# Altium project LIB_TEST.PrjPcb (part 4 of 4)
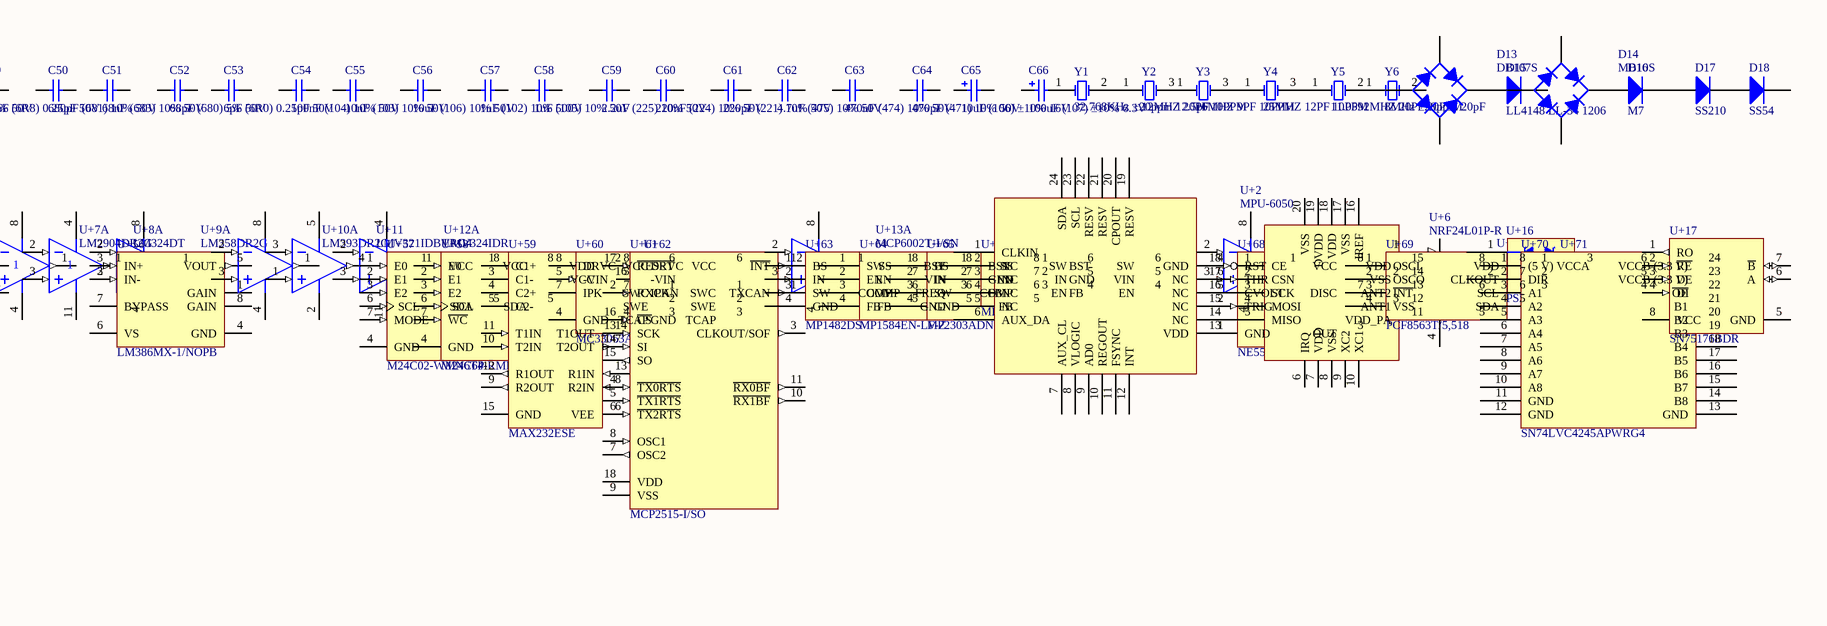
[diagram p8: 3.SchDoc, right]

## Sheet 3.SchDoc (continued)

### Notes on the sheet
- (in symbol CP2102-GMR) CP2102

### Library data of the parts
C1 = 0603 680pF (681) 10% 50V: 贴片电容; ComponentLink1Description: 供应商链接; ComponentLink1URL: http://www.szlcsc.com/product/details_1982.html; Package: 0603; Supplier: LC; SuppliersPartNumber: C1630
C2 = 0603 68nF (683) 10% 50V: 贴片电容; ComponentLink1Description: 供应商链接; ComponentLink1URL: http://www.szlcsc.com/product/details_32617.html; Package: 0603; Supplier: LC; SuppliersPartNumber: C31658
C3 = 0603 68pF (680) 5% 50V: 贴片电容; ComponentLink1Description: 供应商链接; ComponentLink1URL: http://www.szlcsc.com/product/details_29012.html; Package: 0603; Supplier: LC; SuppliersPartNumber: C28262
C4 = 0603 6pF (6R0) 0.25pF 50V: 贴片电容; ComponentLink1Description: 供应商链接; ComponentLink1URL: http://www.szlcsc.com/product/details_38453.html; Package: 0603; Supplier: LC; SuppliersPartNumber: C37474
C5 = 0603 8.2nF (822) 10% 50V: 贴片电容; ComponentLink1Description: 供应商链接; ComponentLink1URL: http://www.szlcsc.com/product/details_28670.html; Package: 0603; Supplier: LC; SuppliersPartNumber: C27920
C6 = 0603 8.2pF (8R2) 0.25pF 50V: 贴片电容; ComponentLink1Description: 供应商链接; ComponentLink1URL: http://www.szlcsc.com/product/details_2037.html; Package: 0603; Supplier: LC; SuppliersPartNumber: C1685
C7 = 0603 82pF (820) 5% 50V: 贴片电容; ComponentLink1Description: 供应商链接; ComponentLink1URL: http://www.szlcsc.com/product/details_2035.html; Package: 0603; Supplier: LC; SuppliersPartNumber: C1683
C8 = 0805 1.0pF (010) 0.25pF 50V: 贴片电容; ComponentLink1Description: 供应商链接; ComponentLink1URL: http://www.szlcsc.com/product/details_15644.html; Package: 0805; Supplier: LC; SuppliersPartNumber: C14971
C9 = 0805 1.5nF (152) 10% 50V: 贴片电容; ComponentLink1Description: 供应商链接; ComponentLink1URL: http://www.szlcsc.com/product/details_2069.html; Package: 0805; Supplier: LC; SuppliersPartNumber: C1717
C10 = 0805 1.5pF (1R5) 0.25pF 50V: 贴片电容; ComponentLink1Description: 供应商链接; ComponentLink1URL: http://www.szlcsc.com/product/details_2140.html; Package: 0805; Supplier: LC; SuppliersPartNumber: C1788
C11 = 0805 100nF(104) 10% 50V: 贴片电容; ComponentLink1Description: 供应商链接; ComponentLink1URL: http://www.szlcsc.com/product/details_50686.html; Package: 0805; Supplier: LC; SuppliersPartNumber: C49678
C12 = 0805 100pF (101) 5% 50V: 贴片电容; ComponentLink1Description: 供应商链接; ComponentLink1URL: http://www.szlcsc.com/product/details_2142.html; Package: 0805; Supplier: LC; SuppliersPartNumber: C1790
C13 = 0805 10nF (103) 10% 50V: 贴片电容; ComponentLink1Description: 供应商链接; ComponentLink1URL: http://www.szlcsc.com/product/details_2062.html; Package: 0805; Supplier: LC; SuppliersPartNumber: C1710
C14 = 0805 10pF (100) 5% 50V: 贴片电容; ComponentLink1Description: 供应商链接; ComponentLink1URL: http://www.szlcsc.com/product/details_2137.html; Package: 0805; Supplier: LC; SuppliersPartNumber: C1785
C15 = 0805 10uF (106) 10% 25V: 贴片电容; ComponentLink1Description: 供应商链接; ComponentLink1URL: http://www.szlcsc.com/product/details_16532.html; Package: 0805; Supplier: LC; SuppliersPartNumber: C15850
C16 = 0805 12pF (120) 5% 50V: 贴片电容; ComponentLink1Description: 供应商链接; ComponentLink1URL: http://www.szlcsc.com/product/details_2144.html; Package: 0805; Supplier: LC; SuppliersPartNumber: C1792
C17 = 0805 150pF (151) 10% 50V: 贴片电容; ComponentLink1Description: 供应商链接; ComponentLink1URL: http://www.szlcsc.com/product/details_2068.html; Package: 0805; Supplier: LC; SuppliersPartNumber: C1716
C18 = 0805 15pF (150) 5% 50V: 贴片电容; ComponentLink1Description: 供应商链接; ComponentLink1URL: http://www.szlcsc.com/product/details_2146.html; Package: 0805; Supplier: LC; SuppliersPartNumber: C1794
C19 = 0805 18pF (180) 5% 50V: 贴片电容; ComponentLink1Description: 供应商链接; ComponentLink1URL: http://www.szlcsc.com/product/details_2149.html; Package: 0805; Supplier: LC; SuppliersPartNumber: C1797
C20 = 0805 1nF (102) 10% 50V: 贴片电容; ComponentLink1Description: 供应商链接; ComponentLink1URL: http://www.szlcsc.com/product/details_52223.html; Package: 0805; Supplier: LC; SuppliersPartNumber: C51210
C21 = 0805 1uF (105) 10% 50V: 贴片电容; ComponentLink1Description: 供应商链接; ComponentLink1URL: http://www.szlcsc.com/product/details_29074.html; Package: 0805; Supplier: LC; SuppliersPartNumber: C28323
C22 = 0805 2.0pF (2R0) 0.25pF 50V: 贴片电容; ComponentLink1Description: 供应商链接; ComponentLink1URL: http://www.szlcsc.com/product/details_2152.html; Package: 0805; Supplier: LC; SuppliersPartNumber: C1800
C23 = 0805 2.2nF (222) 5% 50V: 贴片电容; ComponentLink1Description: 供应商链接; ComponentLink1URL: http://www.szlcsc.com/product/details_29010.html; Package: 0805; Supplier: LC; SuppliersPartNumber: C28260
C24 = 0805 2.2uF (225) 20% 50V: 贴片电容; ComponentLink1Description: 供应商链接; ComponentLink1URL: http://www.szlcsc.com/product/details_50225.html; Package: 0805; Supplier: LC; SuppliersPartNumber: C49217
C25 = 0805 2.7pF (2R7) 0.25pF 50V: 贴片电容; ComponentLink1Description: 供应商链接; ComponentLink1URL: http://www.szlcsc.com/product/details_2155.html; Package: 0805; Supplier: LC; SuppliersPartNumber: C1803
C26 = 0805 200pF (201) 10% 50V: 贴片电容; ComponentLink1Description: 供应商链接; ComponentLink1URL: http://www.szlcsc.com/product/details_2076.html; Package: 0805; Supplier: LC; SuppliersPartNumber: C1724
C27 = 0805 20pF (200) 5% 50V: 贴片电容; ComponentLink1Description: 供应商链接; ComponentLink1URL: http://www.szlcsc.com/product/details_2150.html; Package: 0805; Supplier: LC; SuppliersPartNumber: C1798
C28 = 0805 220nF (224) 10% 50V: 贴片电容; ComponentLink1Description: 供应商链接; ComponentLink1URL: http://www.szlcsc.com/product/details_5810.html; Package: 0805; Supplier: LC; SuppliersPartNumber: C5378
C29 = 0805 220pF (221) 10% 50V: 贴片电容; ComponentLink1Description: 供应商链接; ComponentLink1URL: http://www.szlcsc.com/product/details_54188.html; Package: 0805; Supplier: LC; SuppliersPartNumber: C53172
C30 = 0805 22nF (223) 10% 50V: 贴片电容; ComponentLink1Description: 供应商链接; ComponentLink1URL: http://www.szlcsc.com/product/details_2081.html; Package: 0805; Supplier: LC; SuppliersPartNumber: C1729
C31 = 0805 22pF (220) 5% 50V: 贴片电容; ComponentLink1Description: 供应商链接; ComponentLink1URL: http://www.szlcsc.com/product/details_2156.html; Package: 0805; Supplier: LC; SuppliersPartNumber: C1804
C32 = 0805 22uF (226) 20% 25V: 贴片电容; ComponentLink1Description: 供应商链接; ComponentLink1URL: http://www.szlcsc.com/product/details_46786.html; Package: 0805; Supplier: LC; SuppliersPartNumber: C45783
C33 = 0805 27pF (270) 5% 50V: 贴片电容; ComponentLink1Description: 供应商链接; ComponentLink1URL: http://www.szlcsc.com/product/details_8509.html; Package: 0805; Supplier: LC; SuppliersPartNumber: C8031
C34 = 0805 3.3nF (332) 10% 50V: 贴片电容; ComponentLink1Description: 供应商链接; ComponentLink1URL: http://www.szlcsc.com/product/details_54191.html; Package: 0805; Supplier: LC; SuppliersPartNumber: C53175
C35 = 0805 30pF (300) 5% 50V: 贴片电容; ComponentLink1Description: 供应商链接; ComponentLink1URL: http://www.szlcsc.com/product/details_2161.html; Package: 0805; Supplier: LC; SuppliersPartNumber: C1809
C36 = 0805 330nF (334) 10% 50V: 贴片电容; ComponentLink1Description: 供应商链接; ComponentLink1URL: http://www.szlcsc.com/product/details_2092.html; Package: 0805; Supplier: LC; SuppliersPartNumber: C1740
C37 = 0805 330pF (331) 10% 50V: 贴片电容; ComponentLink1Description: 供应商链接; ComponentLink1URL: http://www.szlcsc.com/product/details_52220.html; Package: 0805; Supplier: LC; SuppliersPartNumber: C51207
C38 = 0805 33nF (333) 10% 50V: 贴片电容; ComponentLink1Description: 供应商链接; ComponentLink1URL: http://www.szlcsc.com/product/details_2091.html; Package: 0805; Supplier: LC; SuppliersPartNumber: C1739
C39 = 0805 33pF (330) 5% 50V: 贴片电容; ComponentLink1Description: 供应商链接; ComponentLink1URL: http://www.szlcsc.com/product/details_2166.html; Package: 0805; Supplier: LC; SuppliersPartNumber: C1814
C40 = 0805 4.7nF (472) 10% 50V: 贴片电容; ComponentLink1Description: 供应商链接; ComponentLink1URL: http://www.szlcsc.com/product/details_2096.html; Package: 0805; Supplier: LC; SuppliersPartNumber: C1744
C41 = 0805 4.7pF (4R7) 0.25pF 50V: 贴片电容; ComponentLink1Description: 供应商链接; ComponentLink1URL: http://www.szlcsc.com/product/details_2172.html; Package: 0805; Supplier: LC; SuppliersPartNumber: C1820
C42 = 0805 4.7uF (475) 10% 25V: 贴片电容; ComponentLink1Description: 供应商链接; ComponentLink1URL: http://www.szlcsc.com/product/details_2131.html; Package: 0805; Supplier: LC; SuppliersPartNumber: C1779
C43 = 0805 470nF (474) 10% 50V: 贴片电容; ComponentLink1Description: 供应商链接; ComponentLink1URL: http://www.szlcsc.com/product/details_14623.html; Package: 0805; Supplier: LC; SuppliersPartNumber: C13967
C44 = 0805 470pF (471) 10% 50V: 贴片电容; ComponentLink1Description: 供应商链接; ComponentLink1URL: http://www.szlcsc.com/product/details_2095.html; Package: 0805; Supplier: LC; SuppliersPartNumber: C1743
C45 = 0805 47nF (473) 10% 50V: 贴片电容; ComponentLink1Description: 供应商链接; ComponentLink1URL: http://www.szlcsc.com/product/details_54150.html; Package: 0805; Supplier: LC; SuppliersPartNumber: C53134
C46 = 0805 47pF (470) 5% 50V: 贴片电容; ComponentLink1Description: 供应商链接; ComponentLink1URL: http://www.szlcsc.com/product/details_15529.html; Package: 0805; Supplier: LC; SuppliersPartNumber: C14857
C47 = 0805 56pF (560) 5% 50V: 贴片电容; ComponentLink1Description: 供应商链接; ComponentLink1URL: http://www.szlcsc.com/product/details_2180.html; Package: 0805; Supplier: LC; SuppliersPartNumber: C1828
C48 = 0805 6.8nF (682) 10% 50V: 贴片电容; ComponentLink1Description: 供应商链接; ComponentLink1URL: http://www.szlcsc.com/product/details_2107.html; Package: 0805; Supplier: LC; SuppliersPartNumber: C1755
C49 = 0805 6.8pF (6R8) 0.25pF 50V: 贴片电容; ComponentLink1Description: 供应商链接; ComponentLink1URL: http://www.szlcsc.com/product/details_2184.html; Package: 0805; Supplier: LC; SuppliersPartNumber: C1832
C50 = 0805 680pF (681) 10% 50V: 贴片电容; ComponentLink1Description: 供应商链接; ComponentLink1URL: http://www.szlcsc.com/product/details_54166.html; Package: 0805; Supplier: LC; SuppliersPartNumber: C53150
C51 = 0805 68nF (683) 10% 50V: 贴片电容; ComponentLink1Description: 供应商链接; ComponentLink1URL: http://www.szlcsc.com/product/details_2108.html; Package: 0805; Supplier: LC; SuppliersPartNumber: C1756
C52 = 0805 68pF (680) 5% 50V: 贴片电容; ComponentLink1Description: 供应商链接; ComponentLink1URL: http://www.szlcsc.com/product/details_2186.html; Package: 0805; Supplier: LC; SuppliersPartNumber: C1834
C53 = 0805 6pF (6R0) 0.25pF 50V: 贴片电容; ComponentLink1Description: 供应商链接; ComponentLink1URL: http://www.szlcsc.com/product/details_68656.html; Package: 0805; Supplier: LC; SuppliersPartNumber: C67560
C54 = 1206 100nF (104) 10% 50V: 贴片电容; ComponentLink1Description: 供应商链接; ComponentLink1URL: http://www.szlcsc.com/product/details_25237.html; Package: 1206; Supplier: LC; SuppliersPartNumber: C24497
C55 = 1206 10nF (103) 10% 50V: 贴片电容; ComponentLink1Description: 供应商链接; ComponentLink1URL: http://www.szlcsc.com/product/details_2198.html; Package: 1206; Supplier: LC; SuppliersPartNumber: C1846
C56 = 1206 10uF (106) 10% 50V: 贴片电容; ComponentLink1Description: 供应商链接; ComponentLink1URL: http://www.szlcsc.com/product/details_14236.html; Package: 1206; Supplier: LC; SuppliersPartNumber: C13585
C57 = 1206 1nF (102) 10% 500V: 贴片电容; ComponentLink1Description: 供应商链接; ComponentLink1URL: http://www.szlcsc.com/product/details_36187.html; Package: 1206; Supplier: LC; SuppliersPartNumber: C35216
C58 = 1206 1uF (105) 10% 50V: 贴片电容; ComponentLink1Description: 供应商链接; ComponentLink1URL: http://www.szlcsc.com/product/details_2200.html; Package: 1206; Supplier: LC; SuppliersPartNumber: C1848
C59 = 1206 2.2uF (225) 10% 50V: 贴片电容; ComponentLink1Description: 供应商链接; ComponentLink1URL: http://www.szlcsc.com/product/details_13292.html; Package: 1206; Supplier: LC; SuppliersPartNumber: C12656
C60 = 1206 220nF (224) 10% 50V: 贴片电容; ComponentLink1Description: 供应商链接; ComponentLink1URL: http://www.szlcsc.com/product/details_2209.html; Package: 1206; Supplier: LC; SuppliersPartNumber: C1857
C61 = 1206 220pF (221) 10% 50V: 贴片电容; ComponentLink1Description: 供应商链接; ComponentLink1URL: http://www.szlcsc.com/product/details_2206.html; Package: 1206; Supplier: LC; SuppliersPartNumber: C1854
C62 = 1206 4.7uF (475) 10% 50V: 贴片电容; ComponentLink1Description: 供应商链接; ComponentLink1URL: http://www.szlcsc.com/product/details_30577.html; Package: 1206; Supplier: LC; SuppliersPartNumber: C29823
C63 = 1206 470nF (474) 10% 50V: 贴片电容; ComponentLink1Description: 供应商链接; ComponentLink1URL: http://www.szlcsc.com/product/details_2223.html; Package: 1206; Supplier: LC; SuppliersPartNumber: C1871
C64 = 1206 470pF (471) 10% 50V: 贴片电容; ComponentLink1Description: 供应商链接; ComponentLink1URL: http://www.szlcsc.com/product/details_2220.html; Package: 1206; Supplier: LC; SuppliersPartNumber: C1868
C65 = 3216 10uF (106) 10% 16V: 钽电容; ComponentLink1Description: 供应商链接; ComponentLink1URL: http://www.szlcsc.com/product/details_7643.html; Package: 3216; Supplier: LC; SuppliersPartNumber: C7171
C66 = 3528 100uF (107) 10% 6.3V: 钽电容; ComponentLink1Description: 供应商链接; ComponentLink1URL: http://www.szlcsc.com/product/details_16815.html; Package: 3528; Supplier: LC; SuppliersPartNumber: C16133
D13 = DBS DB107S: 整流桥; ComponentLink1Description: 供应商链接; ComponentLink1URL: http://www.szlcsc.com/product/details_5809.html; Package: DBS; Supplier: LC; SuppliersPartNumber: C5377
D14 = MBS MB10S: 整流桥; ComponentLink1Description: 供应商链接; ComponentLink1URL: http://www.szlcsc.com/product/details_2865.html; Package: MBS; Supplier: LC; SuppliersPartNumber: C2488
D15 = LL-34 LL4148 LL-34 1206: 开关二极管; ComponentLink1Description: 供应商链接; ComponentLink1URL: http://www.szlcsc.com/product/details_10338.html; Package: LL-34; Supplier: LC; SuppliersPartNumber: C9808
D16 = SMA(DO-214AC) M7: 二极管; ComponentLink1Description: 供应商链接; ComponentLink1URL: http://www.szlcsc.com/product/details_2841.html; Package: SMA(DO-214AC); Supplier: LC; SuppliersPartNumber: C2464
D17 = SMA(DO-214AC) SS210: 二极管; ComponentLink1Description: 供应商链接; ComponentLink1URL: http://www.szlcsc.com/product/details_15669.html; Package: SMA(DO-214AC); Supplier: LC; SuppliersPartNumber: C14996
D18 = SMA(DO-214AC) SS54: 二极管; ComponentLink1Description: 供应商链接; ComponentLink1URL: http://www.szlcsc.com/product/details_23178.html; Package: SMA(DO-214AC); Supplier: LC; SuppliersPartNumber: C22452
D19 = SMA(DO-214AC) US1M: 二极管; ComponentLink1Description: 供应商链接; ComponentLink1URL: http://www.szlcsc.com/product/details_5885.html; Package: SMA(DO-214AC); Supplier: LC; SuppliersPartNumber: C5441
D20 = SMB/DO-214AA P6SMB6.8CA: TVS; ComponentLink1Description: 供应商链接; ComponentLink1URL: http://www.szlcsc.com/product/details_79530.html; Package: SMB/DO-214AA; Supplier: LC; SuppliersPartNumber: C78395
D21 = SMC(DO-214AB) SS36-E3/57T: 二极管; ComponentLink1Description: 供应商链接; ComponentLink1URL: http://www.szlcsc.com/product/details_36698.html; Package: SMC(DO-214AB); Supplier: LC; SuppliersPartNumber: C35722
D22 = SOD-123 B5819W  SL: 肖特基二极管; ComponentLink1Description: 供应商链接; ComponentLink1URL: http://www.szlcsc.com/product/details_9093.html; Package: SOD-123; Supplier: LC; SuppliersPartNumber: C8598
D23 = SOD-323 1N4148WS T4: 二极管; ComponentLink1Description: 供应商链接; ComponentLink1URL: http://www.szlcsc.com/product/details_2485.html; Package: SOD-323; Supplier: LC; SuppliersPartNumber: C2128
D24 = SOT-23 BAV70 A4: 开关二极管; ComponentLink1Description: 供应商链接; ComponentLink1URL: http://www.szlcsc.com/product/details_70091.html; Package: SOT-23; Supplier: LC; SuppliersPartNumber: C68978
D25 = SOT-23 BAV99 A7W: 开关二极管; ComponentLink1Description: 供应商链接; ComponentLink1URL: http://www.szlcsc.com/product/details_2877.html; Package: SOT-23; Supplier: LC; SuppliersPartNumber: C2500
L16 = 0402 10nH 5%: 贴片电感; ComponentLink1Description: 供应商链接; ComponentLink1URL: http://www.szlcsc.com/product/details_27896.html; Package: 0402; Supplier: LC; SuppliersPartNumber: C27147
L17 = 0402 12nH  5%: 贴片电感; ComponentLink1Description: 供应商链接; ComponentLink1URL: http://www.szlcsc.com/product/details_25303.html; Package: 0402; Supplier: LC; SuppliersPartNumber: C24563
L18 = 0402 15nH 5%: 贴片电感; ComponentLink1Description: 供应商链接; ComponentLink1URL: http://www.szlcsc.com/product/details_27892.html; Package: 0402; Supplier: LC; SuppliersPartNumber: C27143
L19 = 0402 18nH: 贴片电感; ComponentLink1Description: 供应商链接; ComponentLink1URL: http://www.szlcsc.com/product/details_25302.html; Package: 0402; Supplier: LC; SuppliersPartNumber: C24562
L20 = 0402 2.7nH 0.3nH: 贴片电感; ComponentLink1Description: 供应商链接; ComponentLink1URL: http://www.szlcsc.com/product/details_27872.html; Package: 0402; Supplier: LC; SuppliersPartNumber: C27123
L21 = 0402 27nH 5%: 贴片电感; ComponentLink1Description: 供应商链接; ComponentLink1URL: http://www.szlcsc.com/product/details_19533.html; Package: 0402; Supplier: LC; SuppliersPartNumber: C18830
L22 = 0402 3.3nH 0.3nH: 贴片电感; ComponentLink1Description: 供应商链接; ComponentLink1URL: http://www.szlcsc.com/product/details_27873.html; Package: 0402; Supplier: LC; SuppliersPartNumber: C27124
L23 = 0402 3.9nH 3%: 贴片电感; ComponentLink1Description: 供应商链接; ComponentLink1URL: http://www.szlcsc.com/product/details_14690.html; Package: 0402; Supplier: LC; SuppliersPartNumber: C14033
L24 = 0402 39nH: 贴片电感; ComponentLink1Description: 供应商链接; ComponentLink1URL: http://www.szlcsc.com/product/details_27187.html; Package: 0402; Supplier: LC; SuppliersPartNumber: C26443
L25 = 0402 4.7nH 0.3nH: 贴片电感; ComponentLink1Description: 供应商链接; ComponentLink1URL: http://www.szlcsc.com/product/details_14246.html; Package: 0402; Supplier: LC; SuppliersPartNumber: C13595
L26 = 0402 6.8nH 5%: 贴片电感; ComponentLink1Description: 供应商链接; ComponentLink1URL: http://www.szlcsc.com/product/details_33003.html; Package: 0402; Supplier: LC; SuppliersPartNumber: C32041
L27 = 0402 8.2nH 5%: 贴片电感; ComponentLink1Description: 供应商链接; ComponentLink1URL: http://www.szlcsc.com/product/details_16890.html; Package: 0402; Supplier: LC; SuppliersPartNumber: C16208
L28 = 0603 10nH 5%: 贴片电感; ComponentLink1Description: 供应商链接; ComponentLink1URL: http://www.szlcsc.com/product/details_16347.html; Package: 0603; Supplier: LC; SuppliersPartNumber: C15666
L29 = 0603 10uH 10%: 贴片电感; ComponentLink1Description: 供应商链接; ComponentLink1URL: http://www.szlcsc.com/product/details_1387.html; Package: 0603; Supplier: LC; SuppliersPartNumber: C1035
L30 = 0603 12nH 5%: 贴片电感; ComponentLink1Description: 供应商链接; ComponentLink1URL: http://www.szlcsc.com/product/details_30010.html; Package: 0603; Supplier: LC; SuppliersPartNumber: C29258
L31 = 0603 22nH 5%: 贴片电感; ComponentLink1Description: 供应商链接; ComponentLink1URL: http://www.szlcsc.com/product/details_12684.html; Package: 0603; Supplier: LC; SuppliersPartNumber: C12099
L32 = 0603 27nH 5%: 贴片电感; ComponentLink1Description: 供应商链接; ComponentLink1URL: http://www.szlcsc.com/product/details_12685.html; Package: 0603; Supplier: LC; SuppliersPartNumber: C12100
L33 = 0603 3.9nH 0.3nH: 贴片电感; ComponentLink1Description: 供应商链接; ComponentLink1URL: http://www.szlcsc.com/product/details_14473.html; Package: 0603; Supplier: LC; SuppliersPartNumber: C13818
L34 = 0603 33nH 5%: 贴片电感; ComponentLink1Description: 供应商链接; ComponentLink1URL: http://www.szlcsc.com/product/details_36021.html; Package: 0603; Supplier: LC; SuppliersPartNumber: C35050
L35 = 0603 4.7nH 0.3nH: 贴片电感; ComponentLink1Description: 供应商链接; ComponentLink1URL: http://www.szlcsc.com/product/details_1382.html; Package: 0603; Supplier: LC; SuppliersPartNumber: C1030
U+1 = HT1621B: LCD驱动; ComponentLink1Description: 供应商链接; ComponentLink1URL: http://www.szlcsc.com/product/details_8009.html; Package: LQFP-48_7x7x05P; Supplier: LC; SuppliersPartNumber: C7532
U+2 = MPU-6050: 传感器; ComponentLink1Description: 供应商链接; ComponentLink1URL: http://www.szlcsc.com/product/details_24852.html; Package: QFN-24_4x4x05P; Supplier: LC; SuppliersPartNumber: C24112
U+3 = CP2102-GMR: USB; ComponentLink1Description: 供应商链接; ComponentLink1URL: http://www.szlcsc.com/product/details_7033.html; Package: QFN-28_5x5x05P; Supplier: LC; SuppliersPartNumber: C6568
U+4 = CP2104-F03-GM: USB; ComponentLink1Description: 供应商链接; ComponentLink1URL: http://www.szlcsc.com/product/details_48747.html; Package: QFN-24_4x4x05P; Supplier: LC; SuppliersPartNumber: C47742
U+5 = CC2530F256RHAT: 无线; ComponentLink1Description: 供应商链接; ComponentLink1URL: http://www.szlcsc.com/product/details_9643.html; Package: QFN-40_6x6x05P; Supplier: LC; SuppliersPartNumber: C9120
U+6 = NRF24L01P-R: 无线; ComponentLink1Description: 供应商链接; ComponentLink1URL: http://www.szlcsc.com/product/details_9305.html; Package: QFN-20_4x4x05P; Supplier: LC; SuppliersPartNumber: C8791
U+7 = LM2904DR2G: 运放; ComponentLink1Description: 供应商链接; ComponentLink1URL: http://www.szlcsc.com/product/details_18922.html; Package: SOIC-8_150mil; Supplier: LC; SuppliersPartNumber: C18229
U+8 = LM324DT: 运放; ComponentLink1Description: 供应商链接; ComponentLink1URL: http://www.szlcsc.com/product/details_72134.html; Package: SOIC-14_150mil; Supplier: LC; SuppliersPartNumber: C71035
U+9 = LM358DR2G: 通用运放; ComponentLink1Description: 供应商链接; ComponentLink1URL: http://www.szlcsc.com/product/details_8427.html; Package: SOIC-8; Supplier: LC; SuppliersPartNumber: C7950
U+10 = LM393DR2G: 电压比较器; ComponentLink1Description: 供应商链接; ComponentLink1URL: http://www.szlcsc.com/product/details_8432.html; Package: SOIC-8; Supplier: LC; SuppliersPartNumber: C7955
U+11 = LMV321IDBVRG4: 运放; ComponentLink1Description: 供应商链接; ComponentLink1URL: http://www.szlcsc.com/product/details_8449.html; Package: SOT-23-5; Supplier: LC; SuppliersPartNumber: C7972
U+12 = LMV324IDR: 运放; ComponentLink1Description: 供应商链接; ComponentLink1URL: http://www.szlcsc.com/product/details_8451.html; Package: SOIC-14_150mil; Supplier: LC; SuppliersPartNumber: C7974
U+13 = MCP6002T-I/SN: 运放; ComponentLink1Description: 供应商链接; ComponentLink1URL: http://www.szlcsc.com/product/details_7854.html; Package: SOIC-8_150mil; Supplier: LC; SuppliersPartNumber: C7377
U+14 = NE5532DR: 功放; ComponentLink1Description: 供应商链接; ComponentLink1URL: http://www.szlcsc.com/product/details_7903.html; Package: SOIC-8_150mil; Supplier: LC; SuppliersPartNumber: C7426
U+15 = CH340G: USB; ComponentLink1Description: 供应商链接; ComponentLink1URL: http://www.szlcsc.com/product/details_14927.html; Package: SOIC-16_150mil; Supplier: LC; SuppliersPartNumber: C14267
U+16 = PSM712-LF-T7: TVS; ComponentLink1Description: 供应商链接; ComponentLink1URL: http://www.szlcsc.com/product/details_33642.html; Package: SOT-23(SOT-23-3); Supplier: LC; SuppliersPartNumber: C32677
U+17 = SN75176BDR: RS-485/RS-422; ComponentLink1Description: 供应商链接; ComponentLink1URL: http://www.szlcsc.com/product/details_7535.html; Package: SOIC-8_150mil; Supplier: LC; SuppliersPartNumber: C7063
U+18 = 74HC04D: 74系列逻辑芯片; ComponentLink1Description: 供应商链接; ComponentLink1URL: http://www.szlcsc.com/product/details_6041.html; Package: SOIC-14_150mil; Supplier: LC; SuppliersPartNumber: C5590
U+19 = 74HC08D: 74系列逻辑芯片; ComponentLink1Description: 供应商链接; ComponentLink1URL: http://www.szlcsc.com/product/details_6044.html; Package: SOIC-14_150mil; Supplier: LC; SuppliersPartNumber: C5593
U+20 = 74HC14D: 74系列逻辑芯片; ComponentLink1Description: 供应商链接; ComponentLink1URL: http://www.szlcsc.com/product/details_6056.html; Package: SOIC-14_150mil; Supplier: LC; SuppliersPartNumber: C5605
U+21 = AD620ARZ-REEL: 仪放; ComponentLink1Description: 供应商链接; ComponentLink1URL: http://www.szlcsc.com/product/details_10205.html; Package: SOIC-8_150mil; Supplier: LC; SuppliersPartNumber: C9675
U+22 = CJ431 0.5%431: 电压基准; ComponentLink1Description: 供应商链接; ComponentLink1URL: http://www.szlcsc.com/product/details_3500.html; Package: SOT-23; Supplier: LC; SuppliersPartNumber: C3113
U+23 = OP07CDR: 精密运放; ComponentLink1Description: 供应商链接; ComponentLink1URL: http://www.szlcsc.com/product/details_7910.html; Package: SOIC-8; Supplier: LC; SuppliersPartNumber: C7433
U+24 = 74HC138D: 74系列逻辑芯片; ComponentLink1Description: 供应商链接; ComponentLink1URL: http://www.szlcsc.com/product/details_6053.html; Package: SOIC-16_150mil; Supplier: LC; SuppliersPartNumber: C5602
U+25 = 74HC164D: 74系列逻辑芯片; ComponentLink1Description: 供应商链接; ComponentLink1URL: http://www.szlcsc.com/product/details_7297.html; Package: SOIC-14_150mil; Supplier: LC; SuppliersPartNumber: C6825
U+26 = 74HC165D: 74系列逻辑芯片; ComponentLink1Description: 供应商链接; ComponentLink1URL: http://www.szlcsc.com/product/details_6064.html; Package: SOIC-16_150mil; Supplier: LC; SuppliersPartNumber: C5613
U+27 = 74HC244D: 74系列逻辑芯片; ComponentLink1Description: 供应商链接; ComponentLink1URL: http://www.szlcsc.com/product/details_6073.html; Package: SOIC-20_300mil; Supplier: LC; SuppliersPartNumber: C5622
U+28 = 74HC245D: 74系列逻辑芯片; ComponentLink1Description: 供应商链接; ComponentLink1URL: http://www.szlcsc.com/product/details_6076.html; Package: SOIC-20_300mil; Supplier: LC; SuppliersPartNumber: C5625
U+29 = 74HC573D: 74系列逻辑芯片; ComponentLink1Description: 供应商链接; ComponentLink1URL: http://www.szlcsc.com/product/details_6059.html; Package: SOIC-20_300mil; Supplier: LC; SuppliersPartNumber: C5608
U+30 = 74HC595D: 74系列逻辑芯片; ComponentLink1Description: 供应商链接; ComponentLink1URL: http://www.szlcsc.com/product/details_6413.html; Package: SOIC-16_150mil; Supplier: LC; SuppliersPartNumber: C5947
U+31 = ACS712ELCTR-20A-T: 传感器; ComponentLink1Description: 供应商链接; ComponentLink1URL: http://www.szlcsc.com/product/details_11225.html; Package: SOIC-8_150mil; Supplier: LC; SuppliersPartNumber: C10681
U+32 = ADM2483BRWZ: 接口芯片; ComponentLink1Description: 供应商链接; ComponentLink1URL: http://www.szlcsc.com/product/details_10167.html; Package: SOIC-16_300mil; Supplier: LC; SuppliersPartNumber: C9637
U+33 = ADUM1201ARZ-RL7: 隔离器; ComponentLink1Description: 供应商链接; ComponentLink1URL: http://www.szlcsc.com/product/details_10199.html; Package: SOIC-8_150mil; Supplier: LC; SuppliersPartNumber: C9669
U+34 = AM26LS31CDRG4: 接口芯片; ComponentLink1Description: 供应商链接; ComponentLink1URL: http://www.szlcsc.com/product/details_6645.html; Package: SOIC-16_150mil; Supplier: LC; SuppliersPartNumber: C6179
U+35 = AM26LS32ACDRG4: 接口芯片; ComponentLink1Description: 供应商链接; ComponentLink1URL: http://www.szlcsc.com/product/details_6646.html; Package: SOIC-16_150mil; Supplier: LC; SuppliersPartNumber: C6180
U+36 = CAN/PCA82C250T/YM: CAN; ComponentLink1Description: 供应商链接; ComponentLink1URL: http://www.szlcsc.com/product/details_7916.html; Package: SOIC-8_150mil; Supplier: LC; SuppliersPartNumber: C7439
U+37 = CAN/SN65HVD230DR: CAN; ComponentLink1Description: 供应商链接; ComponentLink1URL: http://www.szlcsc.com/product/details_12661.html; Package: SOIC-8_150mil; Supplier: LC; SuppliersPartNumber: C12084
U+38 = CAN/TJA1040T/CM: CAN; ComponentLink1Description: 供应商链接; ComponentLink1URL: http://www.szlcsc.com/product/details_7423.html; Package: SOIC-8_150mil; Supplier: LC; SuppliersPartNumber: C6951
U+39 = CAN/TJA1050T/CM: CAN; ComponentLink1Description: 供应商链接; ComponentLink1URL: http://www.szlcsc.com/product/details_7424.html; Package: SOIC-8_150mil; Supplier: LC; SuppliersPartNumber: C6952
U+40 = CAN/TJA1051T/3: CAN; ComponentLink1Description: 供应商链接; ComponentLink1URL: http://www.szlcsc.com/product/details_39678.html; Package: SOIC-8_150mil; Supplier: LC; SuppliersPartNumber: C38695
U+41 = CD4051BM96: 4000系列逻辑芯片; ComponentLink1Description: 供应商链接; ComponentLink1URL: http://www.szlcsc.com/product/details_22096.html; Package: SOIC-16_150mil; Supplier: LC; SuppliersPartNumber: C21379
U+42 = CD4052BM96: 4000系列逻辑芯片; ComponentLink1Description: 供应商链接; ComponentLink1URL: http://www.szlcsc.com/product/details_6986.html; Package: SOIC-16_150mil; Supplier: LC; SuppliersPartNumber: C6521
U+43 = CD4053BM96: 4000系列逻辑芯片; ComponentLink1Description: 供应商链接; ComponentLink1URL: http://www.szlcsc.com/product/details_7208.html; Package: SOIC-16_150mil; Supplier: LC; SuppliersPartNumber: C6742
U+44 = CH376S: USB; ComponentLink1Description: 供应商链接; ComponentLink1URL: http://www.szlcsc.com/product/details_14823.html; Package: SOIC-28_300mil; Supplier: LC; SuppliersPartNumber: C14166
U+45 = DP83848CVVX: 接口芯片; ComponentLink1Description: 供应商链接; ComponentLink1URL: http://www.szlcsc.com/product/details_17371.html; Package: LQFP-48_7x7x05P; Supplier: LC; SuppliersPartNumber: C16688
U+46 = DS1302Z+T&R: 实时时钟; ComponentLink1Description: 供应商链接; ComponentLink1URL: http://www.szlcsc.com/product/details_9478.html; Package: SOIC-8_150mil; Supplier: LC; SuppliersPartNumber: C8959
U+47 = DS3231M+TRL: 实时时钟; ComponentLink1Description: 供应商链接; ComponentLink1URL: http://www.szlcsc.com/product/details_38643.html; Package: SOIC-16_300mil; Supplier: LC; SuppliersPartNumber: C37663
U+48 = DW01+G: 电池保护芯片; ComponentLink1Description: 供应商链接; ComponentLink1URL: http://www.szlcsc.com/product/details_14870.html; Package: SOT-23-6; Supplier: LC; SuppliersPartNumber: C14213
U+49 = EEPROM/AT24C256C-SSHL-T: EEPROM; ComponentLink1Description: 供应商链接; ComponentLink1URL: http://www.szlcsc.com/product/details_6947.html; Package: SOIC-8_150mil; Supplier: LC; SuppliersPartNumber: C6482
U+50 = FT232RL-REEL: USB; ComponentLink1Description: 供应商链接; ComponentLink1URL: http://www.szlcsc.com/product/details_9194.html; Package: SSOP-28_208mil; Supplier: LC; SuppliersPartNumber: C8690
U+51 = FP6291: DC-DC芯片; ComponentLink1Description: 供应商链接; ComponentLink1URL: http://www.szlcsc.com/product/details_19404.html; Package: SOT-23-6; Supplier: LC; SuppliersPartNumber: C18701
U+52 = ICL7660AIBAZA-T: 电源芯片; ComponentLink1Description: 供应商链接; ComponentLink1URL: http://www.szlcsc.com/product/details_8358.html; Package: SOIC-8_150mil; Supplier: LC; SuppliersPartNumber: C7881
U+53 = ISO1050DUBR: CAN; ComponentLink1Description: 供应商链接; ComponentLink1URL: http://www.szlcsc.com/product/details_17110.html; Package: SMD-8_6.3mm; Supplier: LC; SuppliersPartNumber: C16428
U+54 = LM2576SX-5.0: DC-DC芯片; ComponentLink1Description: 供应商链接; ComponentLink1URL: http://www.szlcsc.com/product/details_35434.html; Package: TO-263-5; Supplier: LC; SuppliersPartNumber: C34465
U+55 = LM2596SX-5.0/NOPB: DC-DC芯片; ComponentLink1Description: 供应商链接; ComponentLink1URL: http://www.szlcsc.com/product/details_10538.html; Package: TO-263-5; Supplier: LC; SuppliersPartNumber: C10002
U+56 = LM386MX-1/NOPB: 功放; ComponentLink1Description: 供应商链接; ComponentLink1URL: http://www.szlcsc.com/product/details_24309.html; Package: SOIC-8_150mil; Supplier: LC; SuppliersPartNumber: C23573
U+57 = M24C02-WMN6TP: EEPROM; ComponentLink1Description: 供应商链接; ComponentLink1URL: http://www.szlcsc.com/product/details_8039.html; Package: SOIC-8_150mil; Supplier: LC; SuppliersPartNumber: C7562
U+58 = M24C64-RMN6TP: EEPROM; ComponentLink1Description: 供应商链接; ComponentLink1URL: http://www.szlcsc.com/product/details_81133.html; Package: SOIC-8_150mil; Supplier: LC; SuppliersPartNumber: C79988
U+59 = MAX232ESE: RS232; ComponentLink1Description: 供应商链接; ComponentLink1URL: http://www.szlcsc.com/product/details_27608.html; Package: SOIC-16_150mil; Supplier: LC; SuppliersPartNumber: C26860
U+60 = MC33063ADR2G: 开关电源; ComponentLink1Description: 供应商链接; ComponentLink1URL: http://www.szlcsc.com/product/details_7773.html; Package: SOIC-8_150mil; Supplier: LC; SuppliersPartNumber: C7296
U+61 = MCP2515-I/SO: CAN; ComponentLink1Description: 供应商链接; ComponentLink1URL: http://www.szlcsc.com/product/details_12992.html; Package: SOIC-18_300mil; Supplier: LC; SuppliersPartNumber: C12368
U+62 = MC34063ADR2G: DC-DC芯片; ComponentLink1Description: 供应商链接; ComponentLink1URL: http://www.szlcsc.com/product/details_33041.html; Package: SOIC-8; Supplier: LC; SuppliersPartNumber: C32078
U+63 = MP1482DS: 电源芯片; ComponentLink1Description: 供应商链接; ComponentLink1URL: http://www.szlcsc.com/product/details_15539.html; Package: SOIC-8_150mil; Supplier: LC; SuppliersPartNumber: C14867
U+64 = MP1584EN-LF-Z: DC-DC芯片; ComponentLink1Description: 供应商链接; ComponentLink1URL: http://www.szlcsc.com/product/details_15724.html; Package: SOIC-8_EP_150mil; Supplier: LC; SuppliersPartNumber: C15051
U+65 = MP2303ADN-LF-Z: DC-DC芯片; ComponentLink1Description: 供应商链接; ComponentLink1URL: http://www.szlcsc.com/product/details_19579.html; Package: SOIC-8_EP_150mil; Supplier: LC; SuppliersPartNumber: C18876
U+66 = MP2359DJ-LF-Z: DC-DC芯片; ComponentLink1Description: 供应商链接; ComponentLink1URL: http://www.szlcsc.com/product/details_14917.html; Package: SOT-23-6; Supplier: LC; SuppliersPartNumber: C14259
U+67 = MP2451DT-LF-Z: DC-DC芯片; ComponentLink1Description: 供应商链接; ComponentLink1URL: http://www.szlcsc.com/product/details_14780.html; Package: SOT-23-6; Supplier: LC; SuppliersPartNumber: C14123
U+68 = NE555DR: 时基集成; ComponentLink1Description: 供应商链接; ComponentLink1URL: http://www.szlcsc.com/product/details_8070.html; Package: SOIC-8_150mil; Supplier: LC; SuppliersPartNumber: C7593
U+69 = PCF8563T/5,518: 实时时钟; ComponentLink1Description: 供应商链接; ComponentLink1URL: http://www.szlcsc.com/product/details_7917.html; Package: SOIC-8_150mil; Supplier: LC; SuppliersPartNumber: C7440
U+70 = SN74LVC4245APWRG4: 74系列逻辑芯片; ComponentLink1Description: 供应商链接; ComponentLink1URL: http://www.szlcsc.com/product/details_8336.html; Package: TSSOP-24; Supplier: LC; SuppliersPartNumber: C7859
U+71 = SMF05CT1G: TVS; ComponentLink1Description: 供应商链接; ComponentLink1URL: http://www.szlcsc.com/product/details_16561.html; Package: SC-70-6(SOT-363); Supplier: LC; SuppliersPartNumber: C15879
U+72 = 6N137S(TA): 贴片光耦; ComponentLink1Description: 供应商链接; ComponentLink1URL: http://www.szlcsc.com/product/details_17178.html; Package: SMD-8_6.3mm; Supplier: LC; SuppliersPartNumber: C16496
U+73 = EL357N(B)(TA)-G: 贴片光耦; ComponentLink1Description: 供应商链接; ComponentLink1URL: http://www.szlcsc.com/product/details_7114.html; Package: SOP-4_P2.54; Supplier: LC; SuppliersPartNumber: C6649
U+74 = W5500: 以太网; ComponentLink1Description: 供应商链接; ComponentLink1URL: http://www.szlcsc.com/product/details_33808.html; Package: LQFP-48_7x7x05P; Supplier: LC; SuppliersPartNumber: C32843
U+75 = TL072CDT: 运放; ComponentLink1Description: 供应商链接; ComponentLink1URL: http://www.szlcsc.com/product/details_7433.html; Package: SOIC-8_150mil; Supplier: LC; SuppliersPartNumber: C6961
U+76 = SP3485EN-L/TR: RS-485/RS-422; ComponentLink1Description: 供应商链接; ComponentLink1URL: http://www.szlcsc.com/product/details_9482.html; Package: SOIC-8; Supplier: LC; SuppliersPartNumber: C8963
U+77 = SP485EEN-L/TR: RS-485/RS-422; ComponentLink1Description: 供应商链接; ComponentLink1URL: http://www.szlcsc.com/product/details_7327.html; Package: SOIC-8; Supplier: LC; SuppliersPartNumber: C6855
U+78 = SP3232EEY-L/TR: RS232; ComponentLink1Description: 供应商链接; ComponentLink1URL: http://www.szlcsc.com/product/details_14131.html; Package: TSSOP-16; Supplier: LC; SuppliersPartNumber: C13482
U+79 = SRV05-4-P-T7: TVS; ComponentLink1Description: 供应商链接; ComponentLink1URL: http://www.szlcsc.com/product/details_86537.html; Package: SOT-23-6; Supplier: LC; SuppliersPartNumber: C85364
U+80 = TL494CDR: 开关电源; ComponentLink1Description: 供应商链接; ComponentLink1URL: http://www.szlcsc.com/product/details_20591.html; Package: SOIC-16_150mil; Supplier: LC; SuppliersPartNumber: C19882
U+81 = TM1620: LED驱动; ComponentLink1Description: 供应商链接; ComponentLink1URL: http://www.szlcsc.com/product/details_20288.html; Package: SOIC-20_300mil; Supplier: LC; SuppliersPartNumber: C19579
U+82 = TM1638: LED驱动; ComponentLink1Description: 供应商链接; ComponentLink1URL: http://www.szlcsc.com/product/details_19892.html; Package: SOIC-28_300mil; Supplier: LC; SuppliersPartNumber: C19187
U+83 = TM1640: LED驱动; ComponentLink1Description: 供应商链接; ComponentLink1URL: http://www.szlcsc.com/product/details_42311.html; Package: SOP-28_300mil; Supplier: LC; SuppliersPartNumber: C41327
U+84 = TP4054: 电池电源管理; ComponentLink1Description: 供应商链接; ComponentLink1URL: http://www.szlcsc.com/product/details_33539.html; Package: SOT-23-5; Supplier: LC; SuppliersPartNumber: C32574
U+85 = TP4056: 电池电源管理; ComponentLink1Description: 供应商链接; ComponentLink1URL: http://www.szlcsc.com/product/details_17264.html; Package: SOP-8_EP_150mil; Supplier: LC; SuppliersPartNumber: C16581
U+86 = TP4057: 电池电源管理; ComponentLink1Description: 供应商链接; ComponentLink1URL: http://www.szlcsc.com/product/details_12599.html; Package: SOT-23-6; Supplier: LC; SuppliersPartNumber: C12044
U+87 = TPS5430DDAR: DC-DC芯片; ComponentLink1Description: 供应商链接; ComponentLink1URL: http://www.szlcsc.com/product/details_10396.html; Package: SOP-8_EP_150mil; Supplier: LC; SuppliersPartNumber: C9864
U+88 = TPS54331DR: DC-DC芯片; ComponentLink1Description: 供应商链接; ComponentLink1URL: http://www.szlcsc.com/product/details_10397.html; Package: SOIC-8_150mil; Supplier: LC; SuppliersPartNumber: C9865
U+89 = TPS61040DBVRG4: DC-DC芯片; ComponentLink1Description: 供应商链接; ComponentLink1URL: http://www.szlcsc.com/product/details_8199.html; Package: SOT-23-5; Supplier: LC; SuppliersPartNumber: C7722
U+90 = UC3843BD1R2G: 开关电源; ComponentLink1Description: 供应商链接; ComponentLink1URL: http://www.szlcsc.com/product/details_17096.html; Package: SOIC-8_150mil; Supplier: LC; SuppliersPartNumber: C16414
U+91 = ULN2003AFWG: 大电流驱动; ComponentLink1Description: 供应商链接; ComponentLink1URL: http://www.szlcsc.com/product/details_5880.html; Package: SOIC-16_150mil; Supplier: LC; SuppliersPartNumber: C5437
U+92 = W25Q128FVSIG: Flash ROM; ComponentLink1Description: 供应商链接; ComponentLink1URL: http://www.szlcsc.com/product/details_36072.html; Package: SOIC-8; Supplier: LC; SuppliersPartNumber: C35101
U+93 = ULN2803ADW: 大电流驱动; ComponentLink1Description: 供应商链接; ComponentLink1URL: http://www.szlcsc.com/product/details_10213.html; Package: SOIC-18_300mil; Supplier: LC; SuppliersPartNumber: C9683
U+94 = XL1509-5.0E1: DC-DC芯片; ComponentLink1Description: 供应商链接; ComponentLink1URL: http://www.szlcsc.com/product/details_62115.html; Package: SOP-8_150mil; Supplier: LC; SuppliersPartNumber: C61063
U+95 = XL1509-ADJE1: DC-DC芯片; ComponentLink1Description: 供应商链接; ComponentLink1URL: http://www.szlcsc.com/product/details_75311.html; Package: SOP-8_150mil; Supplier: LC; SuppliersPartNumber: C74192
Y1 = SMD-3215_2P 32.768KHz 20ppm 12.5pF: 贴片晶振; ComponentLink1Description: 供应商链接; ComponentLink1URL: http://www.szlcsc.com/product/details_33310.html; Package: SMD-3215_2P; Supplier: LC; SuppliersPartNumber: C32346
Y2 = SMD-3225_4P  12MHZ 20PF 10PPM: 贴片晶振; ComponentLink1Description: 供应商链接; ComponentLink1URL: http://www.szlcsc.com/product/details_9522.html; Package: SMD-3225_4P; Supplier: LC; SuppliersPartNumber: C9002
Y3 = SMD-3225_4P  16MHZ 9PF 10PPM: 贴片晶振; ComponentLink1Description: 供应商链接; ComponentLink1URL: http://www.szlcsc.com/product/details_14393.html; Package: SMD-3225_4P; Supplier: LC; SuppliersPartNumber: C13738
Y4 = SMD-3225_4P  25MHZ 12PF 10PPM: 贴片晶振; ComponentLink1Description: 供应商链接; ComponentLink1URL: http://www.szlcsc.com/product/details_9526.html; Package: SMD-3225_4P; Supplier: LC; SuppliersPartNumber: C9006
Y5 = SMD-5032_2P 11.0592MHZ 20PF 20PPM: 贴片晶振; ComponentLink1Description: 供应商链接; ComponentLink1URL: http://www.szlcsc.com/product/details_53039.html; Package: SMD-5032_2P; Supplier: LC; SuppliersPartNumber: C52026
Y6 = SMD-5032_2P 8MHz 20ppm 20pF: 贴片晶振; ComponentLink1Description: 供应商链接; ComponentLink1URL: http://www.szlcsc.com/product/details_19261.html; Package: SMD-5032_2P; Supplier: LC; SuppliersPartNumber: C18560